# Altium schematic sheet IN.SchDoc
size A4
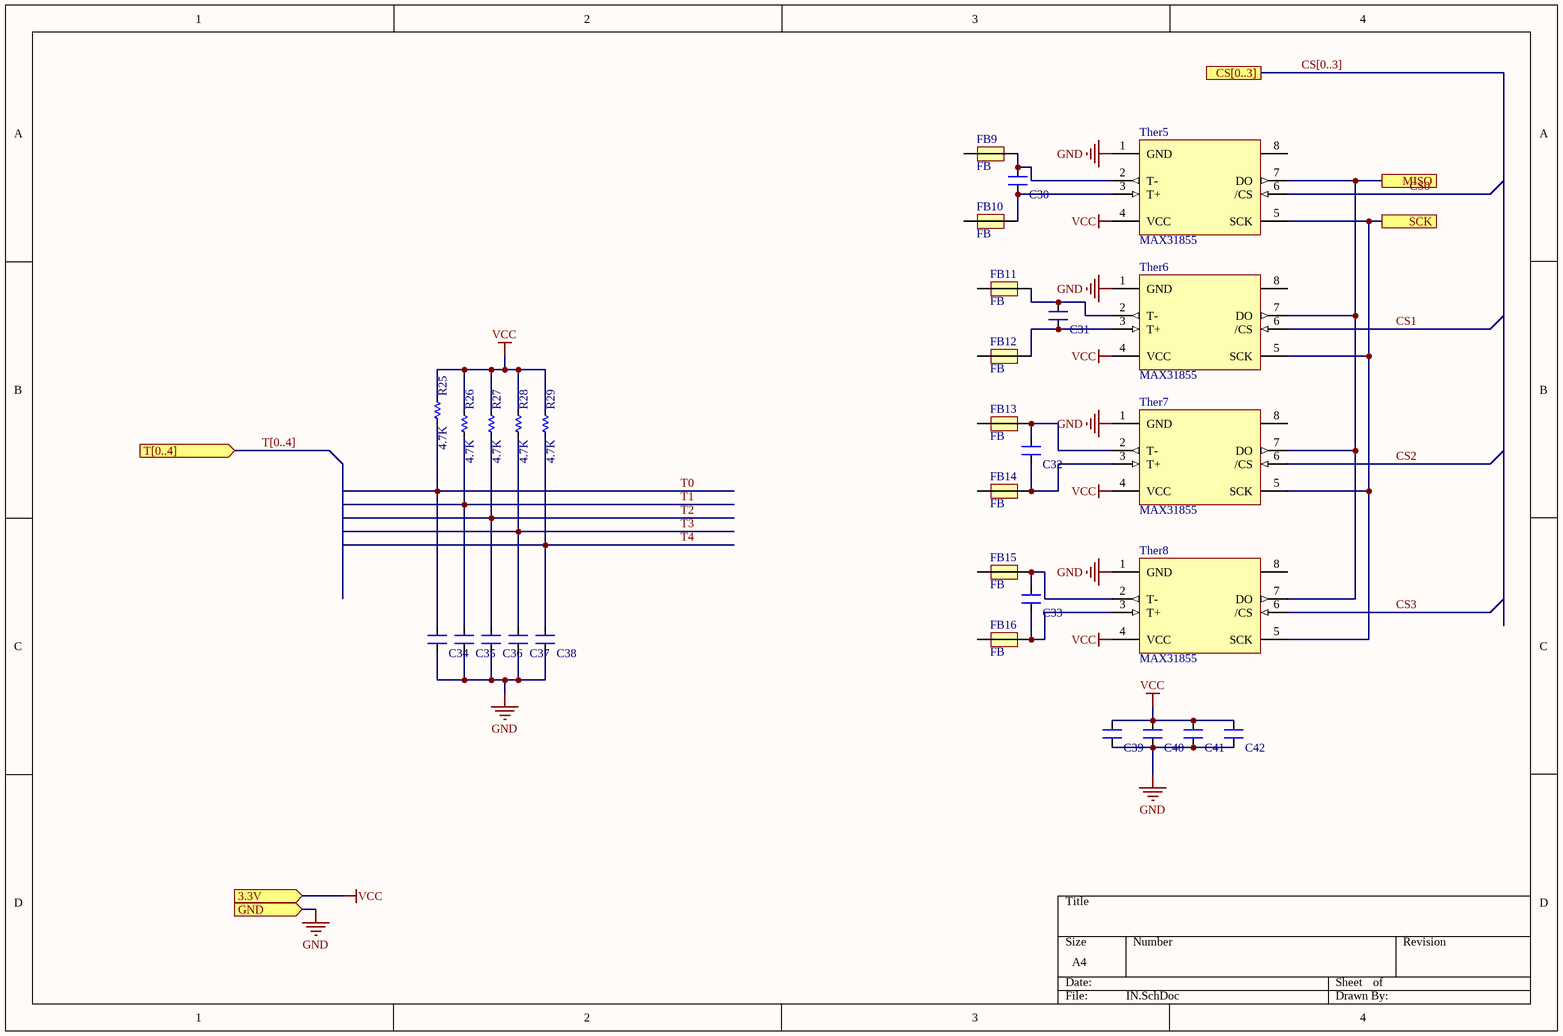
[diagram p0: IN.SchDoc]

## Parts
C30  10nF  [CN-SMD-0603_big]  (value not drawn)
C31  10nF  [CN-SMD-0603_big]  (value not drawn)
C32  10nF  [CN-SMD-0603_big]  (value not drawn)
C33  10nF  [CN-SMD-0603_big]  (value not drawn)
C34  10uF  [CN-SMD-0603_big]  (value not drawn)
C35  10uF  [CN-SMD-0603_big]  (value not drawn)
C36  10uF  [CN-SMD-0603_big]  (value not drawn)
C37  10uF  [CN-SMD-0603_big]  (value not drawn)
C38  10uF  [CN-SMD-0603_big]  (value not drawn)
C39  10nF  [CN-SMD-0603_big]  (value not drawn)
C40  10nF  [CN-SMD-0603_big]  (value not drawn)
C41  10nF  [CN-SMD-0603_big]  (value not drawn)
C42  10nF  [CN-SMD-0603_big]  (value not drawn)
FB9  FB  [Capacitor_805]
FB10  FB  [Capacitor_805]
FB11  FB  [Capacitor_805]
FB12  FB  [Capacitor_805]
FB13  FB  [Capacitor_805]
FB14  FB  [Capacitor_805]
FB15  FB  [Capacitor_805]
FB16  FB  [Capacitor_805]
R25  4.7K  [RES-SMD-0603_BIG]
R26  4.7K  [RES-SMD-0603_BIG]
R27  4.7K  [RES-SMD-0603_BIG]
R28  4.7K  [RES-SMD-0603_BIG]
R29  4.7K  [RES-SMD-0603_BIG]
Ther5  MAX31855  [SO8]
Ther6  MAX31855  [SO8]
Ther7  MAX31855  [SO8]
Ther8  MAX31855  [SO8]

## Ports
3.3V (in), CS[0..3], GND (in), MISO, SCK, T[0..4] (in)

## Nets
GND: C34.1 C35.1 C36.1 C37.1 C38.1 C39.1 C40.1 C41.1 C42.1 Ther5.1(GND) Ther6.1(GND) Ther7.1(GND) Ther8.1(GND) ; port GND
VCC: C39.2 C40.2 C41.2 C42.2 R25.1 R26.1 R27.1 R28.1 R29.1 Ther5.4(VCC) Ther6.4(VCC) Ther7.4(VCC) Ther8.4(VCC) ; port 3.3V
CS0: Ther5.6(/CS)
CS1: Ther6.6(/CS)
CS2: Ther7.6(/CS)
CS3: Ther8.6(/CS)
MISO: Ther5.7(DO) Ther6.7(DO) Ther7.7(DO) Ther8.7(DO) ; port MISO
SCK: Ther5.5(SCK) Ther6.5(SCK) Ther7.5(SCK) Ther8.5(SCK) ; port SCK
T0: C34.2 R25.2
T1: C35.2 R26.2
T2: C36.2 R27.2
T3: C37.2 R28.2
T4: C38.2 R29.2
NetC30_1: C30.1 FB10.2 Ther5.3(T+)
NetC30_2: C30.2 FB9.2 Ther5.2(T-)
NetC31_1: C31.1 FB12.2 Ther6.3(T+)
NetC31_2: C31.2 FB11.2 Ther6.2(T-)
NetC32_1: C32.1 FB14.2 Ther7.3(T+)
NetC32_2: C32.2 FB13.2 Ther7.2(T-)
NetC33_1: C33.1 FB16.2 Ther8.3(T+)
NetC33_2: C33.2 FB15.2 Ther8.2(T-)

Not connected (* = marked no-connect by the designer): FB9 1; FB10 1; FB11 1; FB12 1; FB13 1; FB14 1; FB15 1; FB16 1; Ther5 8; Ther6 8; Ther7 8; Ther8 8

## Buses and harness runs
bus CS[0..3] = port CS[0..3]
bus T[0..4] = port T[0..4]

## Library data of the parts
C30-C42 = CN: Value: 33pF
R25-R29 = R
Ther5-Ther8 = MAX31855: ComponentLink1Description: ADUM1201; ComponentLink1URL: https://thegioiic.com/products/adum1201arz